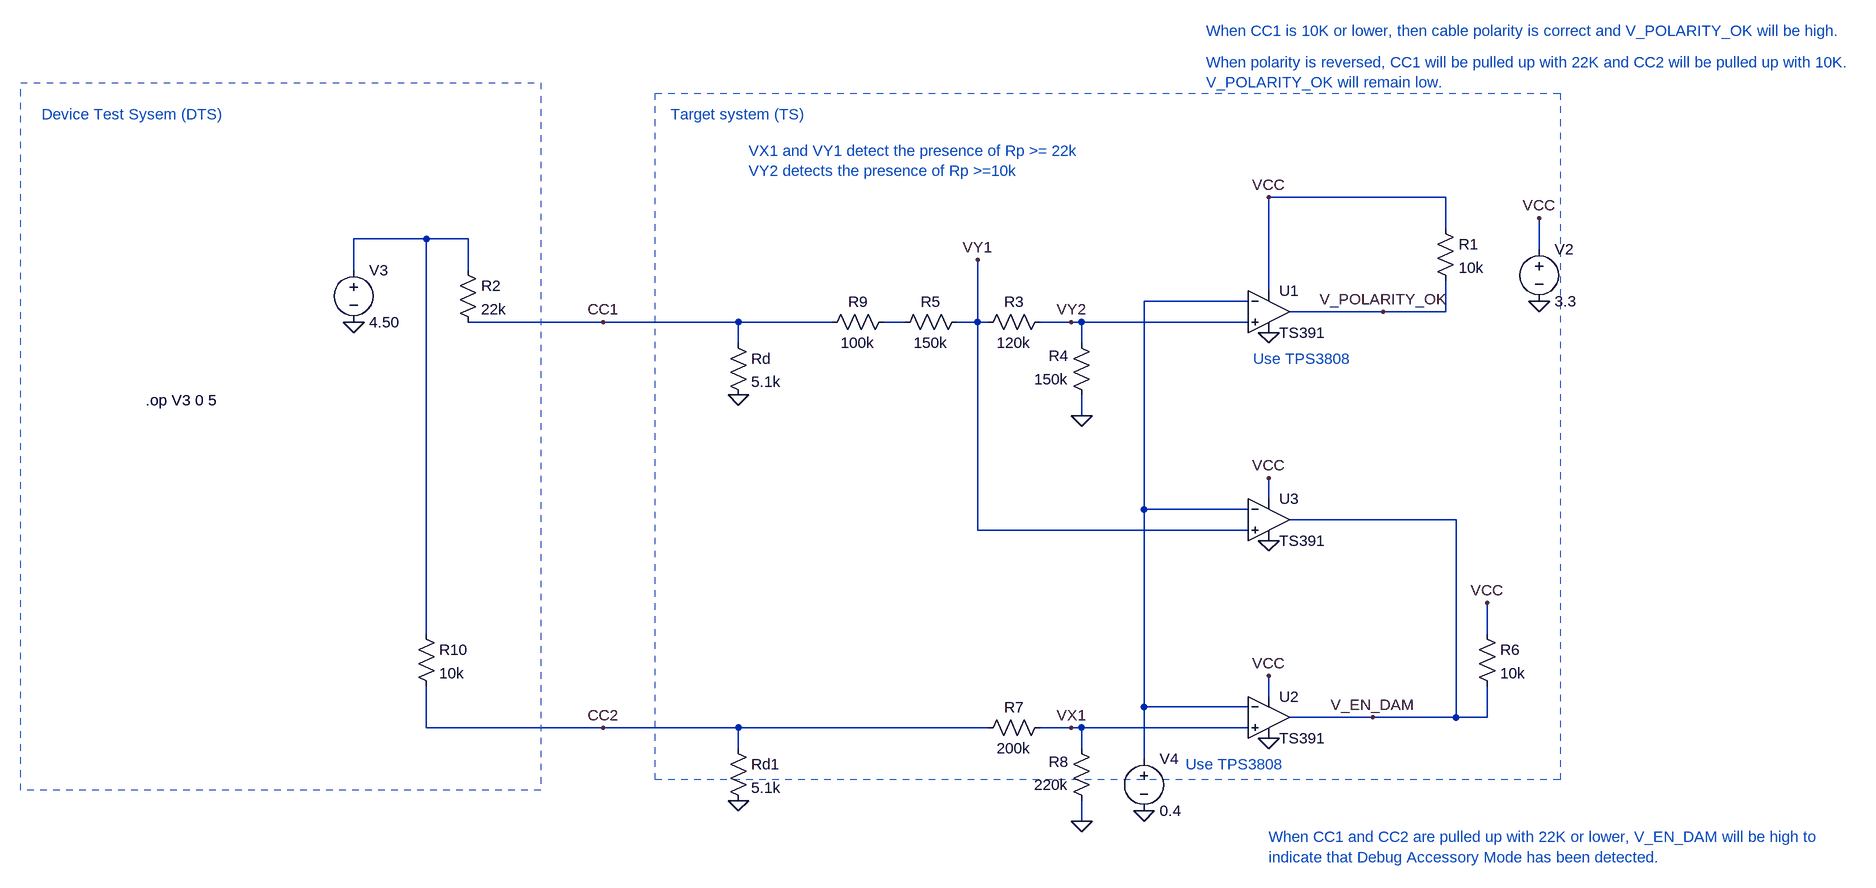
[diagram p0: schematic dam_detection.asc]
dam_detection.asc, the LTspice schematic file:
Version 4
SHEET 1 1740 1012
WIRE 1024 -16 752 -16
WIRE 1024 32 1024 -16
WIRE -544 48 -656 48
WIRE -480 48 -544 48
WIRE 1168 64 1168 16
WIRE -656 96 -656 48
WIRE -480 96 -480 48
WIRE 752 128 752 -16
WIRE 720 144 560 144
WIRE 928 160 784 160
WIRE 1024 160 1024 112
WIRE 1024 160 928 160
WIRE -272 176 -480 176
WIRE -64 176 -272 176
WIRE 80 176 -64 176
WIRE 192 176 160 176
WIRE 304 176 304 80
WIRE 304 176 272 176
WIRE 320 176 304 176
WIRE 448 176 400 176
WIRE 464 176 448 176
WIRE 720 176 464 176
WIRE -64 208 -64 176
WIRE 464 208 464 176
WIRE 464 320 464 288
WIRE 752 448 752 416
WIRE 560 464 560 144
WIRE 720 464 560 464
WIRE 1040 480 784 480
WIRE 304 496 304 176
WIRE 720 496 304 496
WIRE -544 656 -544 48
WIRE 1088 656 1088 608
WIRE 752 752 752 720
WIRE 560 768 560 464
WIRE 720 768 560 768
WIRE 912 784 784 784
WIRE 1040 784 1040 480
WIRE 1040 784 912 784
WIRE 1088 784 1088 736
WIRE 1088 784 1040 784
WIRE -544 800 -544 736
WIRE -272 800 -544 800
WIRE -64 800 -272 800
WIRE 320 800 -64 800
WIRE 448 800 400 800
WIRE 464 800 448 800
WIRE 720 800 464 800
WIRE -64 832 -64 800
WIRE 464 832 464 800
WIRE 560 848 560 768
WIRE 464 944 464 912
FLAG 752 192 0
FLAG -64 288 0
FLAG 1168 144 0
FLAG -656 176 0
FLAG 928 160 V_POLARITY_OK
FLAG 464 320 0
FLAG -272 176 CC1
FLAG 560 928 0
FLAG 752 816 0
FLAG 912 784 V_EN_DAM
FLAG 464 944 0
FLAG -64 912 0
FLAG -272 800 CC2
FLAG 448 800 VX1
FLAG 448 176 VY2
FLAG 304 80 VY1
FLAG 752 512 0
FLAG 1168 16 VCC
FLAG 752 -16 VCC
FLAG 752 416 VCC
FLAG 752 720 VCC
FLAG 1088 608 VCC
SYMBOL Parts_TCO\\TS391 752 96 R0
SYMATTR InstName U1
SYMBOL res -80 192 R0
SYMATTR InstName Rd
SYMATTR Value 5.1k
SYMBOL res 1008 16 R0
SYMATTR InstName R1
SYMATTR Value 10k
SYMBOL voltage 1168 48 R0
WINDOW 123 0 0 Left 0
WINDOW 39 0 0 Left 0
SYMATTR InstName V2
SYMATTR Value 3.3
SYMBOL res -496 80 R0
SYMATTR InstName R2
SYMATTR Value 22k
SYMBOL voltage -656 80 R0
WINDOW 123 0 0 Left 0
WINDOW 39 0 0 Left 0
SYMATTR InstName V3
SYMATTR Value 4.50
SYMBOL res 416 160 R90
WINDOW 0 0 56 VBottom 2
WINDOW 3 32 56 VTop 2
SYMATTR InstName R3
SYMATTR Value 120k
SYMBOL res 480 304 R180
WINDOW 0 36 76 Left 2
WINDOW 3 36 40 Left 2
SYMATTR InstName R4
SYMATTR Value 150k
SYMBOL res 288 160 R90
WINDOW 0 0 56 VBottom 2
WINDOW 3 32 56 VTop 2
SYMATTR InstName R5
SYMATTR Value 150k
SYMBOL Parts_TCO\\TS391 752 720 R0
SYMATTR InstName U2
SYMBOL voltage 560 832 R0
WINDOW 123 0 0 Left 0
WINDOW 39 0 0 Left 0
SYMATTR InstName V4
SYMATTR Value 0.4
SYMBOL res 1072 640 R0
SYMATTR InstName R6
SYMATTR Value 10k
SYMBOL res 416 784 R90
WINDOW 0 0 56 VBottom 2
WINDOW 3 32 56 VTop 2
SYMATTR InstName R7
SYMATTR Value 200k
SYMBOL res 480 928 R180
WINDOW 0 36 76 Left 2
WINDOW 3 36 40 Left 2
SYMATTR InstName R8
SYMATTR Value 220k
SYMBOL res -80 816 R0
SYMATTR InstName Rd1
SYMATTR Value 5.1k
SYMBOL res -560 640 R0
SYMATTR InstName R10
SYMATTR Value 10k
SYMBOL res 176 160 R90
WINDOW 0 0 56 VBottom 2
WINDOW 3 32 56 VTop 2
SYMATTR InstName R9
SYMATTR Value 100k
SYMBOL Parts_TCO\\TS391 752 416 R0
SYMATTR InstName U3
TEXT -168 -144 Left 2 ;Target system (TS)
TEXT -1136 -144 Left 2 ;Device Test Sysem (DTS)
TEXT 728 232 Left 2 ;Use TPS3808
TEXT 624 856 Left 2 ;Use TPS3808
TEXT -976 296 Left 2 !.op V3 0 5
TEXT -48 -88 Left 2 ;VX1 and VY1 detect the presence of Rp >= 22k\nVY2 detects the presence of Rp >=10k
TEXT 752 968 Left 2 ;When CC1 and CC2 are pulled up with 22K or lower, V_EN_DAM will be high to\nindicate that Debug Accessory Mode has been detected.
TEXT 656 -272 Left 2 ;When CC1 is 10K or lower, then cable polarity is correct and V_POLARITY_OK will be high.
TEXT 656 -224 Left 2 ;When polarity is reversed, CC1 will be pulled up with 22K and CC2 will be pulled up with 10K.\nV_POLARITY_OK will remain low.
RECTANGLE Normal 1200 880 -192 -176 2
RECTANGLE Normal -368 896 -1168 -192 2

The netlist it stands for:
* dam_detection.asc
* U1: TS391 (symbol Parts_TCO\TS391 not available, pins judged from their places): In+=VY2 In-=N002 V+=VCC V-=0 OUT=V_POLARITY_OK
Rd CC1 0 5.1k
R1 VCC V_POLARITY_OK 10k
V2 VCC 0 3.3
R2 N001 CC1 22k
V3 N001 0 4.50
R3 VY2 VY1 120k
R4 0 VY2 150k
R5 VY1 N003 150k
* U2: TS391 (symbol Parts_TCO\TS391 not available, pins judged from their places): In+=VX1 In-=N002 V+=VCC V-=0 OUT=V_EN_DAM
V4 N002 0 0.4
R6 VCC V_EN_DAM 10k
R7 VX1 CC2 200k
R8 0 VX1 220k
Rd1 CC2 0 5.1k
R10 N001 CC2 10k
R9 N003 CC1 100k
* U3: TS391 (symbol Parts_TCO\TS391 not available, pins judged from their places): In+=VY1 In-=N002 V+=VCC V-=0 OUT=V_EN_DAM
* Target system (TS)
* Device Test Sysem (DTS)
* Use TPS3808
* Use TPS3808
.op V3 0 5
* VX1 and VY1 detect the presence of Rp >= 22k
* VY2 detects the presence of Rp >=10k
* When CC1 and CC2 are pulled up with 22K or lower, V_EN_DAM will be high to
* indicate that Debug Accessory Mode has been detected.
* When CC1 is 10K or lower, then cable polarity is correct and V_POLARITY_OK will be high.
* When polarity is reversed, CC1 will be pulled up with 22K and CC2 will be pulled up with 10K.
* V_POLARITY_OK will remain low.
.backanno
.end